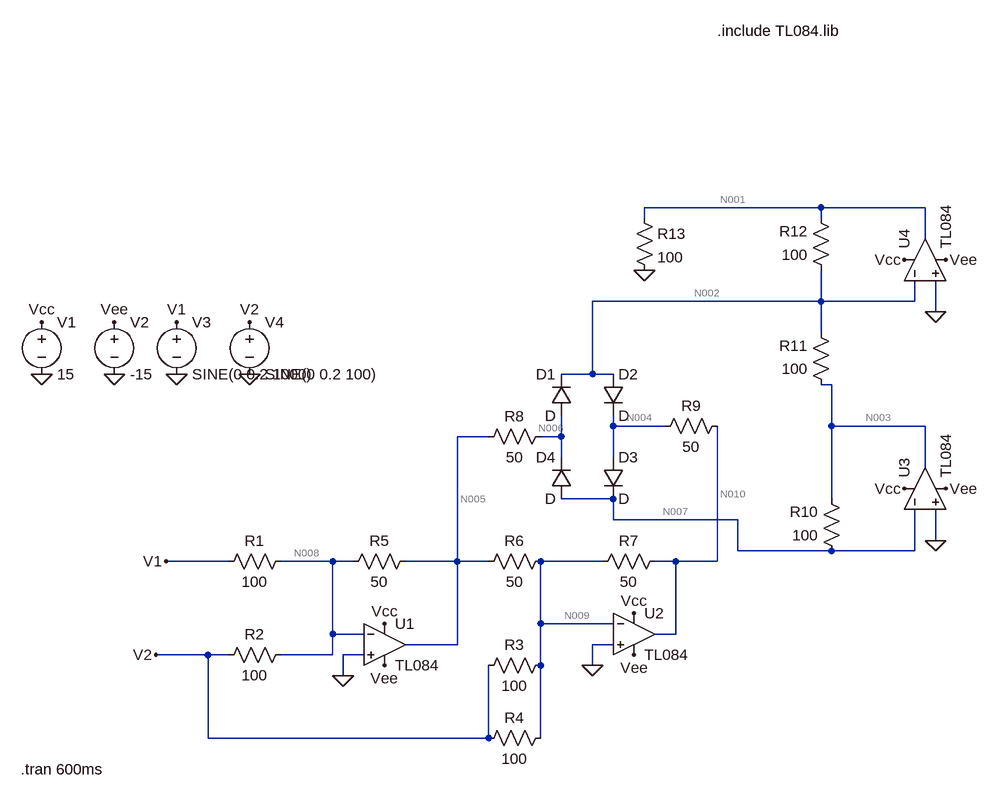
[diagram p0: schematic ez_multiplier.asc]
ez_multiplier.asc, the LTspice schematic file:
Version 4
SHEET 1 1308 756
WIRE 1056 -128 784 -128
WIRE 1216 -128 1056 -128
WIRE 784 -112 784 -128
WIRE 1056 -112 1056 -128
WIRE 1216 -80 1216 -128
WIRE 1056 16 1056 -32
WIRE 1056 16 704 16
WIRE 1200 16 1200 -16
WIRE 1200 16 1056 16
WIRE 1232 32 1232 -16
WIRE 1056 64 1056 16
WIRE 704 128 704 16
WIRE 704 128 656 128
WIRE 736 128 704 128
WIRE 1072 144 1056 144
WIRE 736 208 736 192
WIRE 816 208 736 208
WIRE 1072 208 1072 144
WIRE 1216 208 1072 208
WIRE 544 224 496 224
WIRE 656 224 656 192
WIRE 656 224 624 224
WIRE 656 256 656 224
WIRE 736 256 736 208
WIRE 1216 272 1216 208
WIRE 736 320 656 320
WIRE 1072 320 1072 208
WIRE 736 352 736 320
WIRE 928 352 736 352
WIRE 1232 384 1232 336
WIRE 928 400 928 352
WIRE 1072 400 928 400
WIRE 1200 400 1200 336
WIRE 1200 400 1072 400
WIRE 144 416 48 416
WIRE 304 416 224 416
WIRE 336 416 304 416
WIRE 496 416 496 224
WIRE 496 416 416 416
WIRE 544 416 496 416
WIRE 720 416 624 416
WIRE 832 416 800 416
WIRE 896 416 896 208
WIRE 896 416 832 416
WIRE 624 512 624 416
WIRE 736 512 624 512
WIRE 304 528 304 416
WIRE 352 528 304 528
WIRE 832 528 832 416
WIRE 832 528 800 528
WIRE 496 544 496 416
WIRE 496 544 416 544
WIRE 736 544 704 544
WIRE 112 560 32 560
WIRE 144 560 112 560
WIRE 304 560 304 528
WIRE 304 560 224 560
WIRE 352 560 320 560
WIRE 624 576 624 512
WIRE 704 576 704 544
WIRE 320 592 320 560
WIRE 112 688 112 560
WIRE 544 688 544 576
WIRE 544 688 112 688
WIRE 624 688 624 576
FLAG 64 128 0
FLAG -32 128 0
FLAG -144 128 0
FLAG -144 48 Vcc
FLAG -32 48 Vee
FLAG 64 48 V1
FLAG 176 128 0
FLAG 176 48 V2
FLAG 384 512 Vcc
FLAG 1184 304 Vcc
FLAG 1184 -48 Vcc
FLAG 768 496 Vcc
FLAG 384 576 Vee
FLAG 768 560 Vee
FLAG 1248 304 Vee
FLAG 1248 -48 Vee
FLAG 1232 32 0
FLAG 1232 384 0
FLAG 704 576 0
FLAG 320 592 0
FLAG 48 416 V1
FLAG 32 560 V2
FLAG 784 -32 0
SYMBOL voltage -144 32 R0
WINDOW 123 0 0 Left 0
WINDOW 39 0 0 Left 0
SYMATTR InstName V1
SYMATTR Value 15
SYMBOL voltage -32 32 R0
WINDOW 123 0 0 Left 0
WINDOW 39 0 0 Left 0
SYMATTR InstName V2
SYMATTR Value -15
SYMBOL voltage 64 32 R0
WINDOW 123 0 0 Left 0
WINDOW 39 0 0 Left 0
SYMATTR InstName V3
SYMATTR Value SINE(0 0.2 1000)
SYMBOL voltage 176 32 R0
WINDOW 123 0 0 Left 0
WINDOW 39 0 0 Left 0
SYMATTR InstName V4
SYMATTR Value SINE(0 0.2 100)
SYMBOL res 240 400 R90
WINDOW 0 0 56 VBottom 2
WINDOW 3 32 56 VTop 2
SYMATTR InstName R1
SYMATTR Value 100
SYMBOL res 240 544 R90
WINDOW 0 0 56 VBottom 2
WINDOW 3 32 56 VTop 2
SYMATTR InstName R2
SYMATTR Value 100
SYMBOL res 640 560 R90
WINDOW 0 0 56 VBottom 2
WINDOW 3 32 56 VTop 2
SYMATTR InstName R3
SYMATTR Value 100
SYMBOL res 640 672 R90
WINDOW 0 0 56 VBottom 2
WINDOW 3 32 56 VTop 2
SYMATTR InstName R4
SYMATTR Value 100
SYMBOL res 432 400 R90
WINDOW 0 0 56 VBottom 2
WINDOW 3 32 56 VTop 2
SYMATTR InstName R5
SYMATTR Value 50
SYMBOL res 640 400 R90
WINDOW 0 0 56 VBottom 2
WINDOW 3 32 56 VTop 2
SYMATTR InstName R6
SYMATTR Value 50
SYMBOL res 816 400 R90
WINDOW 0 0 56 VBottom 2
WINDOW 3 32 56 VTop 2
SYMATTR InstName R7
SYMATTR Value 50
SYMBOL res 640 208 R90
WINDOW 0 0 56 VBottom 2
WINDOW 3 32 56 VTop 2
SYMATTR InstName R8
SYMATTR Value 50
SYMBOL res 912 192 R90
WINDOW 0 0 56 VBottom 2
WINDOW 3 32 56 VTop 2
SYMATTR InstName R9
SYMATTR Value 50
SYMBOL res 1088 416 R180
WINDOW 0 36 76 Left 2
WINDOW 3 36 40 Left 2
SYMATTR InstName R10
SYMATTR Value 100
SYMBOL res 1072 160 R180
WINDOW 0 36 76 Left 2
WINDOW 3 36 40 Left 2
SYMATTR InstName R11
SYMATTR Value 100
SYMBOL res 1072 -16 R180
WINDOW 0 36 76 Left 2
WINDOW 3 36 40 Left 2
SYMATTR InstName R12
SYMATTR Value 100
SYMBOL Opamps\\opamp2 384 480 R0
SYMATTR InstName U1
SYMATTR Value TL084
SYMBOL Opamps\\opamp2 768 464 R0
SYMATTR InstName U2
SYMATTR Value TL084
SYMBOL Opamps\\opamp2 1152 304 R270
SYMATTR InstName U3
SYMATTR Value TL084
SYMBOL Opamps\\opamp2 1152 -48 R270
SYMATTR InstName U4
SYMATTR Value TL084
SYMBOL diode 672 192 R180
WINDOW 0 24 64 Left 2
WINDOW 3 24 0 Left 2
SYMATTR InstName D1
SYMBOL diode 720 128 R0
SYMATTR InstName D2
SYMBOL diode 720 256 R0
SYMATTR InstName D3
SYMBOL diode 672 320 R180
WINDOW 0 24 64 Left 2
WINDOW 3 24 0 Left 2
SYMATTR InstName D4
SYMBOL res 768 -128 R0
SYMATTR InstName R13
SYMATTR Value 100
TEXT -176 736 Left 2 !.tran 600ms
TEXT 896 -400 Left 2 !.include TL084.lib

The netlist it stands for:
* ez_multiplier.asc
V1 Vcc 0 15
V2 Vee 0 -15
V3 V1 0 SINE(0 0.2 1000)
V4 V2 0 SINE(0 0.2 100)
R1 N008 V1 100
R2 N008 V2 100
R3 N009 V2 100
R4 N009 V2 100
R5 N005 N008 50
R6 N009 N005 50
R7 N010 N009 50
R8 N006 N005 50
R9 N010 N004 50
R10 N007 N003 100
R11 N003 N002 100
R12 N002 N001 100
XU1 0 N008 Vcc Vee N005 TL084  ; pins In+ In- V+ V- OUT
XU2 0 N009 Vcc Vee N010 TL084  ; pins In+ In- V+ V- OUT
XU3 0 N007 Vcc Vee N003 TL084  ; pins In+ In- V+ V- OUT
XU4 0 N002 Vcc Vee N001 TL084  ; pins In+ In- V+ V- OUT
D1 N006 N002 D
D2 N002 N004 D
D3 N004 N007 D
D4 N007 N006 D
R13 N001 0 100
.model D D
.lib standard.dio
.tran 600ms
.include TL084.lib
.backanno
.end

* Results of the author's LTspice run, read from the files saved beside the schematic
* Operating Point, zero values left out:
*   V(vcc) = 15 V
*   V(vee) = -15 V
*   V(n008) = 10.97 µV
*   V(n009) = 10.97 µV
*   V(n005) = 21.94 µV
*   V(n010) = 10.97 µV
*   V(n006) = 21.94 µV
*   V(n004) = 10.97 µV
*   V(n007) = 10.97 µV
*   V(n003) = 10.98 µV
*   V(n002) = 10.97 µV
*   V(n001) = 10.97 µV
*   I(R13) = 109.7 nA
*   I(R12) = 1.438 pA
*   I(R11) = 46.49 pA
*   I(R10) = -45.05 pA
*   I(R7) = 24.95 pA
*   I(R6) = -219.4 nA
*   I(R5) = 219.4 nA
*   I(R4) = 109.7 nA
*   I(R3) = 109.7 nA
*   I(R2) = 109.7 nA
*   I(R1) = 109.7 nA
*   I(V4) = 329.1 nA
*   I(V3) = 109.7 nA
*   I(V2) = 56.78 mA
*   I(V1) = -56.78 mA
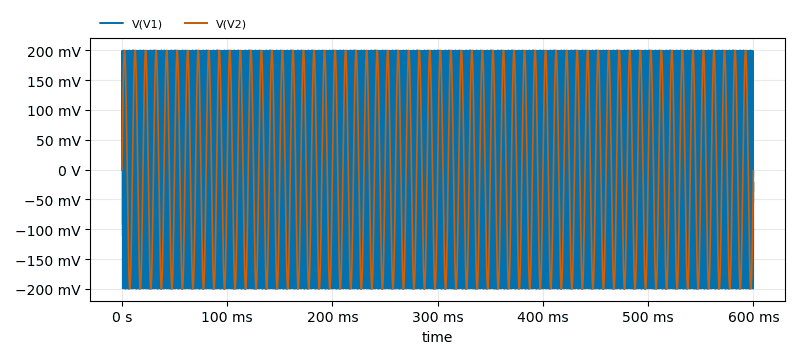
[diagram p1: Transient Analysis of ez_multiplier.asc, plotted from the saved traces]
* Transient Analysis, 1 run:
*   V(V1): min -200 mV, max 200 mV, average -13.07 µV, rms 142 mV, last 0 V
*   V(V2): min -200 mV, max 200 mV, average 0 V, rms 141.4 mV, last 0 V